# EAGLE schematic supply (EAGLE 6.3)
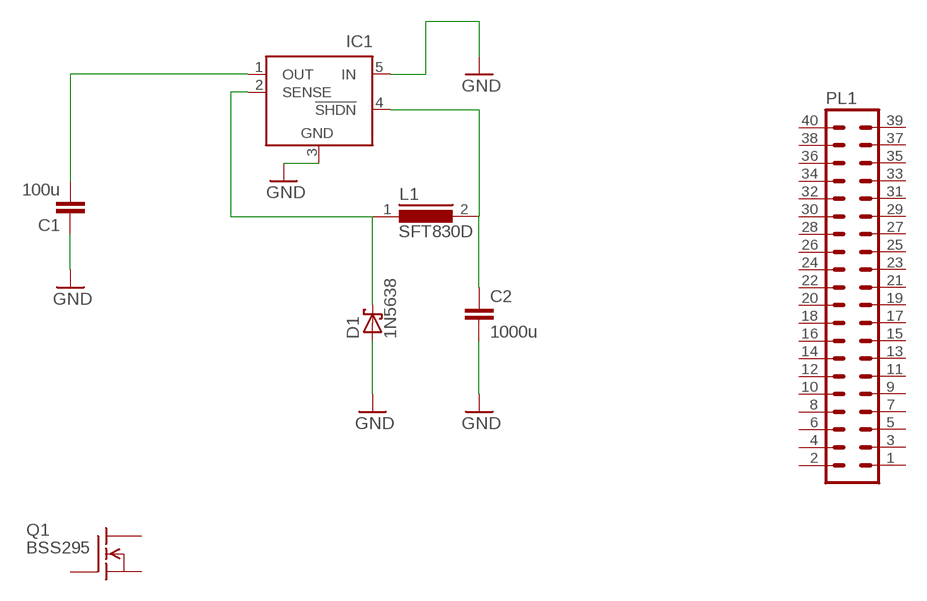
[diagram p0: schematic, sheet 1]

## Parts
C1  100u  C2,5-3  [C2.5-3]
C2  1000u  C2,5-3  [C2.5-3]
D1  1N5638  [DO13M]
IC1  LT1129CT-5  [TO220-5]
L1  SFT830D  [SFT830D]
PL1  40V  [40V]
Q1  BSS295  [TO92]

## Nets
GND: C1.1 C2.2 D1.A IC1.3(GND) IC1.5(IN)
N$1: C1.2 IC1.1(OUT)
N$2: D1.C IC1.2(SENSE) L1.1
N$3: C2.1 IC1.4(!SHDN) L1.2
Unconnected: PL1.1 PL1.2 PL1.3 PL1.4 PL1.5 PL1.6 PL1.7 PL1.8 PL1.9 PL1.10 PL1.11 PL1.12 PL1.13 PL1.14 PL1.15 PL1.16 PL1.17 PL1.18 PL1.19 PL1.20 PL1.21 PL1.22 PL1.23 PL1.24 PL1.25 PL1.26 PL1.27 PL1.28 PL1.29 PL1.30 PL1.31 PL1.32 PL1.33 PL1.34 PL1.35 PL1.36 PL1.37 PL1.38 PL1.39 PL1.40 Q1.1(G) Q1.2(D) Q1.3(S)

## Library data of the parts
C1 C2 = capacitor-wima:C: CAPACITOR naming: grid - package width
D1 = diode:1N5638: DIODE schottky
IC1 = linear-technology:LT1129CT-5: VOLTAGE REGULATOR with shutdown; MPN: LT1129CT-5#PBF; OC_FARNELL: 9560106; OC_NEWARK: 57M2088
L1 = inductors:SFT830D: INDUCTOR
PL1 = con-harting-v:40V: CONNECTOR; OC_FARNELL: unknown; OC_NEWARK: unknown
Q1 = transistor-fet:BSS295: N-Channel Enhancement MOSFET not checked